# Altium schematic sheet [01] VS1053.SchDoc
size A4
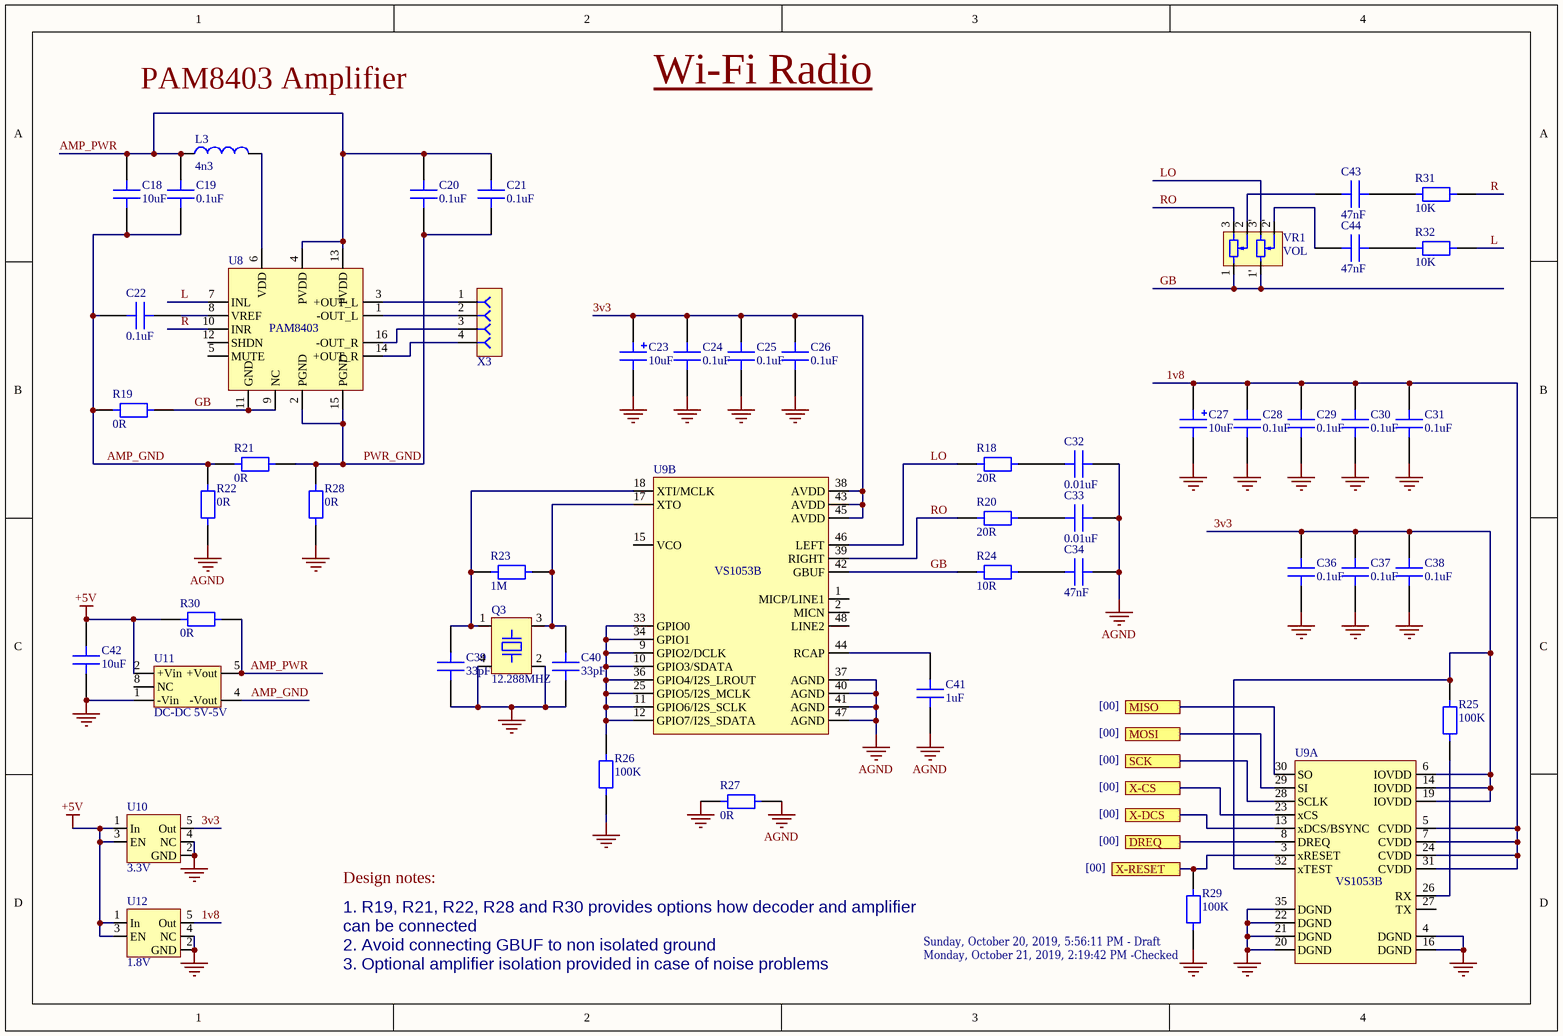
[diagram p0: [01] VS1053.SchDoc]

## Parts
C18  10uF  [CAP 0603]
C19  0.1uF  [CAP 0603]
C20  0.1uF  [CAP 0603]
C21  0.1uF  [CAP 0603]
C22  0.1uF  [CAP 0603]
C23  10uF  [CAP 1206]
C24  0.1uF  [CAP 0603]
C25  0.1uF  [CAP 0603]
C26  0.1uF  [CAP 0603]
C27  10uF  [CAP 1206]
C28  0.1uF  [CAP 0603]
C29  0.1uF  [CAP 0603]
C30  0.1uF  [CAP 0603]
C31  0.1uF  [CAP 0603]
C32  0.01uF  [CAP 0603]
C33  0.01uF  [CAP 0603]
C34  47nF  [CAP 0603]
C36  0.1uF  [CAP 0603]
C37  0.1uF  [CAP 0603]
C38  0.1uF  [CAP 0603]
C39  33pF  [CAP 0603]
C40  33pF  [CAP 0603]
C41  1uF  [CAP 0603]
C42  10uF  [CAP 0805]
C43  47nF  [CAP 0603]
C44  47nF  [CAP 0603]
L3  4n3  [IND 0603 LQW]
Q3  12.288MHZ  [ABM8W]
R18  20R  [RES 0603]
R19  0R  [RES 0805 - Jumper]
R20  20R  [RES 0603]
R21  0R  [RES 0805 - Jumper]
R22  0R  [RES 0805 - Jumper]
R23  1M  [RES 0603]
R24  10R  [RES 0603]
R25  100K  [RES 0603]
R26  100K  [RES 0603]
R27  0R  [RES 0603 - Jumper]
R28  0R  [RES 0805 - Jumper]
R29  100K  [RES 0603]
R30  0R  [RES 0805 - Jumper]
R31  10K  [RES 0603]
R32  10K  [RES 0603]
U8  PAM8403  [SOP-16]
U9  VS1053B  [LQFP-48]  (parts A,B of 2)
U10  3.3V  [SOT-23-5]
U11  DC-DC 5V-5V  [R1SE DC/DC]
U12  1.8V  [SOT-23-5]
VR1  VOL  [POT PTD902]
X3  0393570004  [TRMINAL 3.5MM]  (value not drawn)

## Ports
DREQ, MISO, MOSI, SCK, X-CS, X-DCS, X-RESET

## Nets
+5V: C42.2 R30.1 U10.1(In) U10.3(EN) U11.2(+Vin) U12.1(In) U12.3(EN)
AGND: C32.2 C33.2 C34.2 C41.1 R22.1 R27.2 U9.37(AGND) U9.40(AGND) U9.41(AGND) U9.47(AGND)
GND: C23.2 C24.1 C25.1 C26.1 C27.2 C28.1 C29.1 C30.1 C31.1 C36.1 C37.1 C38.1 C39.1 C40.1 C42.1 Q3.2(GND) Q3.4(GND) R26.1 R27.1 R28.1 R29.1 U9.4(DGND) U9.16(DGND) U9.20(DGND) U9.21(DGND) U9.22(DGND) U9.35(DGND) U10.2(GND) U10.4(NC) U11.1(-Vin) U12.2(GND) U12.4(NC)
1v8: C27.1 C28.2 C29.2 C30.2 C31.2 U9.5(CVDD) U9.7(CVDD) U9.24(CVDD) U9.31(CVDD) U12.5(Out)
3v3: C23.1 C24.2 C25.2 C26.2 C36.2 C37.2 C38.2 R25.1 U9.6(IOVDD) U9.14(IOVDD) U9.19(IOVDD) U9.32(xTEST) U9.38(AVDD) U9.43(AVDD) U9.45(AVDD) U10.5(Out)
AMP_GND: C18.1 C19.1 C22.2 R19.2 R21.1 R22.2 U11.4(-Vout)
AMP_PWR: C18.2 C19.2 C20.2 C21.2 L3.1 R30.2 U8.4(PVDD) U8.13(PVDD) U11.5(+Vout)
DREQ: U9.8(DREQ) ; port DREQ
GB: R19.1 R24.1 U8.9(NC) U8.11(GND) U9.42(GBUF) VR1.1 VR1.1'
L: R32.2 U8.7(INL)
LO: R18.1 U9.46(LEFT) VR1.3'
MISO: U9.30(SO) ; port MISO
MOSI: U9.29(SI) ; port MOSI
PWR_GND: C20.1 C21.1 R21.2 R28.2 U8.2(PGND) U8.15(PGND)
R: R31.2 U8.10(INR)
RO: R20.1 U9.39(RIGHT) VR1.3
SCK: U9.28(SCLK) ; port SCK
X-CS: U9.23(xCS) ; port X-CS
X-DCS: U9.13(xDCS/BSYNC) ; port X-DCS
X-RESET: R29.2 U9.3(xRESET) ; port X-RESET
NetC22_1: C22.1 U8.8(VREF)
NetC32_1: C32.1 R18.2
NetC33_1: C33.1 R20.2
NetC34_1: C34.1 R24.2
NetC39_2: C39.2 Q3.1 R23.1 U9.18(XTI/MCLK)
NetC40_2: C40.2 Q3.3 R23.2 U9.17(XTO)
NetC41_2: C41.2 U9.44(RCAP)
NetC43_1: C43.1 VR1.2
NetC43_2: C43.2 R31.1
NetC44_1: C44.1 VR1.2'
NetC44_2: C44.2 R32.1
NetL3_2: L3.2 U8.6(VDD)
NetR25_2: R25.2 U9.26(RX)
NetR26_2: R26.2 U9.9(GPIO2/DCLK) U9.10(GPIO3/SDATA) U9.11(GPIO6/I2S_SCLK) U9.12(GPIO7/I2S_SDATA) U9.25(GPIO5/I2S_MCLK) U9.33(GPIO0) U9.34(GPIO1) U9.36(GPIO4/I2S_LROUT)
NetU8_1: U8.1(-OUT_L) X3.2
NetU8_3: U8.3(+OUT_L) X3.1
NetU8_14: U8.14(+OUT_R) X3.4
NetU8_16: U8.16(-OUT_R) X3.3

Not connected (* = marked no-connect by the designer): U8 5(MUTE) 12(SHDN); U9 1(MICP/LINE1) 2(MICN) 15(VCO) 27(TX) 48(LINE2); U11 8(NC)

## Notes on the sheet
- PAM8403 Amplifier
- Wi-Fi Radio
- Volume Control
- VS1053B MP3 Decoder
- [00]
- Power
- Design notes:
- 1. R19, R21, R22, R28 and R30 provides options how decoder and amplifier can be connected
  2. Avoid connecting GBUF to non isolated ground
  3. Optional amplifier isolation provided in case of noise problems
- (near R29) Sunday, ‎October ‎20, ‎2019, ‏‎5:56:11 PM - Draft
- (near R29) ‎Monday, ‎October ‎21, ‎2019, ‏‎2:19:42 PM -Checked

## Library data of the parts
C18 = C0603C106M9PACTU: CAP CER 10UF 0603 6.3V; Manufacturer: KEMET; Dielectric Material: Ceramic; Tolerance: 20%; Dielectric: X5R; Supplier 1: Digi-Key; Supplier Part Number 1: 399-5504-1-ND; Manufacturer Part Number: C0603C106M9PACTU; Stock 1: 97190; Pricing 1: 1=0.49, 10=0.34, 100=0.2042, 500=0.1531, 1000=0.1293 (USD); Mount: Surface Mount; Case/Package: 0603; Min Operating Temperature: -55°C; Max Operating Temperature: 85°C; Capacitance: 10uF; Packaging: Tape and Reel; Voltage: 6.3V; Termination: SMD/SMT; Length: 1.6mm; Height: 0.8mm; Depth: 0.8mm; Radiation Hardening: No; ComponentLink1URL: http://www.farnell.com/datasheets/2739682.pdf?src-supplier=Farnell; ComponentLink1Description: http://www.farnell.com/datasheets/2739682.pdf?src-supplier=Farnell; ComponentLink2URL: http://uk.rs-online.com/webdocs/1515/0900766b8151511d.pdf?src-supplier=RSComponents; ComponentLink2Description: http://uk.rs-online.com/webdocs/1515/0900766b8151511d.pdf?src-supplier=RSComponents; ComponentLink3URL: http://www.farnell.com/datasheets/1918694.pdf?src-supplier=Farnell; ComponentLink3Description: http://www.farnell.com/datasheets/1918694.pdf?src-supplier=Farnell; ComponentLink4URL: http://www.farnell.com/datasheets/2315129.pdf?src-supplier=RSComponents; ComponentLink4Description: http://www.farnell.com/datasheets/2315129.pdf?src-supplier=RSComponents; ComponentLink5URL: http://www.kemet.com/kemet/web/homepage/kechome.nsf/weben/ADB5E2666EC6BA90CA2570A50016092E/$file/KEM_C1005_Y5V_SMD.pdf?src-supplier=Avnet; ComponentLink5Description: http://www.kemet.com/kemet/web/homepage/kechome.nsf/weben/ADB5E2666EC6BA90CA2570A50016092E/$file/KEM_C1005_Y5V_SMD.pdf?src-supplier=Avnet; ComponentLink6URL: http://www.farnell.com/datasheets/2315129.pdf?src-supplier=Verical; ComponentLink6Description: http://www.farnell.com/datasheets/2315129.pdf?src-supplier=Verical; ComponentLink7URL: http://www.farnell.com/datasheets/2739682.pdf?src-supplier=Newark; ComponentLink7Description: http://www.farnell.com/datasheets/2739682.pdf?src-supplier=Newark; ComponentLink8URL: https://api.kemet.com/component-edge/download/datasheet/C0603C106M9PACTU.pdf?src-supplier=Digi-Key; ComponentLink8Description: https://api.kemet.com/component-edge/download/datasheet/C0603C106M9PACTU.pdf?src-supplier=Digi-Key; ComponentLink9URL: http://www.farnell.com/datasheets/2123796.pdf?src-supplier=Element14; ComponentLink9Description: http://www.farnell.com/datasheets/2123796.pdf?src-supplier=Element14; ComponentLink10URL: http://www.farnell.com/datasheets/2315129.pdf?src-supplier=Avnet+Asia; ComponentLink10Description: http://www.farnell.com/datasheets/2315129.pdf?src-supplier=Avnet+Asia; ComponentLink11URL: http://www.farnell.com/datasheets/2315129.pdf?src-supplier=Allied+Electronics; ComponentLink11Description: http://www.farnell.com/datasheets/2315129.pdf?src-supplier=Allied+Electronics; ComponentLink12URL: http://components.arrow.com/part/dataview/0323_00011321?src-supplier=Arrow+Europe; ComponentLink12Description: http://components.arrow.com/part/dataview/0323_00011321?src-supplier=Arrow+Europe; ComponentLink13URL: http://components.arrow.com/part/dataview/42932973S8313645N7429?src-supplier=Arrow; ComponentLink13Description: http://components.arrow.com/part/dataview/42932973S8313645N7429?src-supplier=Arrow; ComponentLink14URL: http://www.farnell.com/datasheets/2315129.pdf?src-supplier=Mouser; ComponentLink14Description: http://www.farnell.com/datasheets/2315129.pdf?src-supplier=Mouser; ComponentLink15URL: https://www.verical.com/server-webapp/html/getDatasheet?partID=353664&src-supplier=Verical; ComponentLink15Description: https://www.verical.com/server-webapp/html/getDatasheet?partID=353664&src-supplier=Verical; ComponentLink16URL: http://capacitoredge.kemet.com/capedge2/DataSheet?pn=C0603C106M9PAC7867&src-supplier=Avnet; ComponentLink16Description: http://capacitoredge.kemet.com/capedge2/DataSheet?pn=C0603C106M9PAC7867&src-supplier=Avnet; ComponentLink17URL: http://www.farnell.com/datasheets/2315129.pdf?src-supplier=Distrelec; ComponentLink17Description: http://www.farnell.com/datasheets/2315129.pdf?src-supplier=Distrelec; ComponentLink18URL: http://www.kemet.com/kemet/web/homepage/kechome.nsf/file/Commercial%20Ceramic%20Chips%20X5R%20Dielectric/$file/KEM_C1006_X5R_SMD.pdf?src-supplier=Element14; ComponentLink18Description: http://www.kemet.com/kemet/web/homepage/kechome.nsf/file/Commercial%20Ceramic%20Chips%20X5R%20Dielectric/$file/KEM_C1006_X5R_SMD.pdf?src-supplier=Element14; ComponentLink19URL: http://www.farnell.com/datasheets/2315129.pdf?src-supplier=TME; ComponentLink19Description: http://www.farnell.com/datasheets/2315129.pdf?src-supplier=TME; ComponentLink20URL: http://www.farnell.com/datasheets/2315129.pdf?src-supplier=TTI; ComponentLink20Description: http://www.farnell.com/datasheets/2315129.pdf?src-supplier=TTI; ComponentLink21URL: http://www.farnell.com/datasheets/2315129.pdf?src-supplier=Quest; ComponentLink21Description: http://www.farnell.com/datasheets/2315129.pdf?src-supplier=Quest
C19-C22 C24-C26 C28-C31 C36-C38 = VJ0603Y104JXXAC: CAP CER 0.1uF 0603- SMD/SMT .1UF 25V 5% 0603; Manufacturer: Vishay Vitramon; Capacitance: 100nF; Dielectric: X7R; Supplier 1: Digi-Key; Supplier Part Number 1: 720-1545-1-ND; Manufacturer Part Number: VJ0603Y104JXXAC; Stock 1: 126786; Pricing 1: 1=0.34, 10=0.233, 100=0.1397, 500=0.1048, 1000=0.0885 (USD); Mount: Surface Mount; Case/Package: 0603; Case Code (Metric): 1608; Case Code (Imperial): 0603; Min Operating Temperature: -55°C; Max Operating Temperature: 125°C; Package Quantity: 4000; Voltage Rating: 25V; Tolerance: 5%; Packaging: Tape and Reel; Voltage Rating (DC): 25V; Termination: SMD/SMT; Length: 1.6mm; Width: 0.031inch; Thickness: 0.036inch; Depth: 0.8mm; Radiation Hardening: No; ComponentLink1URL: http://www.vishay.com/docs/45199/vjcommercialseries.pdf?src-supplier=Digi-Key; ComponentLink1Description: http://www.vishay.com/docs/45199/vjcommercialseries.pdf?src-supplier=Digi-Key
C23 C27 = 293D106X96R3A2TE3: CAP TANT 10UF 1206 6.3V 10%; Manufacturer: Vishay Sprague; Dielectric Material: Tantalum; ESR (Equivalent Series Resistance): 3.4R; Ripple Current: 150mA; Leakage Current: 600nA; Polarity: Polar; Dissipation Factor: 6%; Q Factor: 6; Supplier 1: Digi-Key; Supplier Part Number 1: 718-1126-1-ND; Manufacturer Part Number: 293D106X96R3A2TE3; Stock 1: 57716; Pricing 1: 1=0.3, 10=0.212, 100=0.127, 500=0.0952, 1000=0.0804 (USD); Mount: Surface Mount,PCB; Case/Package: 1206; Case Code (Metric): 3216; Case Code (Imperial): 1206; Min Operating Temperature: -55°C; Max Operating Temperature: 125°C; Capacitance: 10uF; Tolerance: 10%; Voltage Rating: 6.3V; Packaging: Tape and Reel; Voltage Rating (DC): 6.3V; Package Quantity: 1; Termination: SMD/SMT; Voltage: 6.3V; Features: General Purpose; Length: 3.2mm; Height: 1.6mm; Width: 1.6mm; Height - Seated (Max): 0.071inch; Depth: 1.6mm; Radiation Hardening: No; REACH SVHC: Unknown; Lead Free: Lead Free; ComponentLink1URL: http://www.vishay.com/docs/40002/293d.pdf?src-supplier=Avnet; ComponentLink1Description: http://www.vishay.com/docs/40002/293d.pdf?src-supplier=Avnet; ComponentLink2URL: http://www.farnell.com/datasheets/2045658.pdf?src-supplier=Element14; ComponentLink2Description: http://www.farnell.com/datasheets/2045658.pdf?src-supplier=Element14; ComponentLink3URL: http://documents.rs-components.com/techlib://itc_doclist_GB.htm?stockno=6843913&src-supplier=RSComponents; ComponentLink3Description: http://documents.rs-components.com/techlib://itc_doclist_GB.htm?stockno=6843913&src-supplier=RSComponents; ComponentLink4URL: https://www.alliedelec.com/m/d/7dc9f301682605e5c5665c787edb7bb9.pdf?src-supplier=Allied+Electronics; ComponentLink4Description: https://www.alliedelec.com/m/d/7dc9f301682605e5c5665c787edb7bb9.pdf?src-supplier=Allied+Electronics; ComponentLink5URL: http://www.vishay.com/docs/40002/293d.pdf?src-supplier=Digi-Key; ComponentLink5Description: http://www.vishay.com/docs/40002/293d.pdf?src-supplier=Digi-Key; ComponentLink6URL: http://www.mouser.com/ds/2/427/293d-239871.pdf?src-supplier=Mouser; ComponentLink6Description: http://www.mouser.com/ds/2/427/293d-239871.pdf?src-supplier=Mouser; ComponentLink7URL: http://www.vishay.com/docs/40002/293d.pdf?src-supplier=Avnet+Europe; ComponentLink7Description: http://www.vishay.com/docs/40002/293d.pdf?src-supplier=Avnet+Europe; ComponentLink8URL: http://www.farnell.com/datasheets/438417.pdf?src-supplier=Element14; ComponentLink8Description: http://www.farnell.com/datasheets/438417.pdf?src-supplier=Element14; Category: Capacitors
C32 C33 = VJ0603Y103KXAAC: CAP CER 0.01uF 0603 10 nF 50 V ±10 % Tolerance X7R SMT Multilayer Ceramic Chip Capacitor; Manufacturer: Vishay Vitramon; Tolerance: 10%; Capacitance: 10nF; Voltage Rating: 50V; Supplier 1: Digi-Key; Supplier Part Number 1: 720-1376-1-ND; Manufacturer Part Number: VJ0603Y103KXAAC; Stock 1: 728512; Pricing 1: 1=0.26, 10=0.179, 100=0.1013, 500=0.0715, 1000=0.0625 (USD); Mount: Surface Mount; Case/Package: 0603; Number of Pins: 2; Weight: 7.1E-05oz; Case Code (Metric): 1608; Case Code (Imperial): 0603; Contact Plating: Tin,Matte; Min Operating Temperature: -55°C; Max Operating Temperature: 125°C; Packaging: Tape and Reel; Package Quantity: 4000; Voltage Rating (DC): 50V; Dielectric: X7R; Termination: SMD/SMT; Voltage: 50V; Length: 1.6mm; Height: 0.92mm; Width: 0.031inch; Thickness: 0.036inch; Depth: 0.8mm; Radiation Hardening: No; REACH SVHC: Unknown; Lead Free: Lead Free; ComponentLink1URL: http://www.farnell.com/datasheets/1805045.pdf?src-supplier=Element14; ComponentLink1Description: http://www.farnell.com/datasheets/1805045.pdf?src-supplier=Element14; ComponentLink2URL: http://www.farnell.com/datasheets/2049137.pdf?src-supplier=Element14; ComponentLink2Description: http://www.farnell.com/datasheets/2049137.pdf?src-supplier=Element14; ComponentLink3URL: http://www.farnell.com/datasheets/50102.pdf?src-supplier=Element14; ComponentLink3Description: http://www.farnell.com/datasheets/50102.pdf?src-supplier=Element14; ComponentLink4URL: http://www.vishay.com/docs/45051/vjvitramonpackaging.pdf?src-supplier=Digi-Key; ComponentLink4Description: http://www.vishay.com/docs/45051/vjvitramonpackaging.pdf?src-supplier=Digi-Key
C34 C43 C44 = VJ0603Y473JXXCW1BC: CAP CER 47nF 0603 25 V ±5 % Tolerance X7R SMT Multilayer Ceramic Chip Capacitor; Manufacturer: Vishay Vitramon; Dielectric Material: Tantalum; Tolerance: 5%; Voltage Rating: 25V; Supplier 1: Digi-Key; Supplier Part Number 1: 720-1696-1-ND; Manufacturer Part Number: VJ0603Y473JXXCW1BC; Stock 1: 4000; Pricing 1: 1=0.19, 10=0.137, 100=0.0643, 500=0.0451, 1000=0.0373 (USD); Mount: Surface Mount; Case/Package: 0603; Case Code (Imperial): 0603; Case Code (Metric): 1608; Min Operating Temperature: -55°C; Max Operating Temperature: 125°C; Capacitance: 47nF; Packaging: Tape and Reel; Voltage Rating (DC): 25V; Package Quantity: 4000; Dielectric: X7R; Termination: SMD/SMT; Length: 1.6mm; Height: 0.95mm; Width: 0.8mm; Depth: 0.8mm; Radiation Hardening: No; Lead Free: Lead Free; ComponentLink1URL: http://www.vishay.com/docs/28548/vjw1bcbascomseries.pdf?src-supplier=Future+Electronics; ComponentLink1Description: http://www.vishay.com/docs/28548/vjw1bcbascomseries.pdf?src-supplier=Future+Electronics
C39 C40 = 251R14S330GV4T: CAP CER 33PF 0603 250V C0G/NP0; Manufacturer: Johanson; Dielectric Material: Ceramic; Tolerance: 2%; Dielectric: C0G; Temperature Coefficient: 30ppm/°C; Supplier 1: Digi-Key; Supplier Part Number 1: 712-1341-1-ND; Manufacturer Part Number: 251R14S330GV4T; Stock 1: 29771; Pricing 1: 1=0.56, 10=0.394, 100=0.2596, 500=0.1923, 1000=0.1634 (USD); Mount: Surface Mount; Case/Package: 0603; Number of Pins: 2; Case Code (Metric): 1608; Case Code (Imperial): 0603; Min Operating Temperature: -55°C; Max Operating Temperature: 125°C; Package Quantity: 4000; Capacitance: 33pF; Voltage Rating: 250V; Packaging: Tape and Reel; Voltage Rating (DC): 250V; Termination: SMD/SMT; Length: 0.062inch; Height: 0.89mm; Width: 0.032inch; Thickness: 0.035inch; Depth: 0.81mm; REACH SVHC: Unknown; ComponentLink1URL: http://www.farnell.com/datasheets/1731432.pdf?src-supplier=Element14; ComponentLink1Description: http://www.farnell.com/datasheets/1731432.pdf?src-supplier=Element14; ComponentLink2URL: http://www.farnell.com/datasheets/1318610.pdf?src-supplier=Element14; ComponentLink2Description: http://www.farnell.com/datasheets/1318610.pdf?src-supplier=Element14; ComponentLink3URL: http://www.farnell.com/datasheets/321205.pdf?src-supplier=Farnell; ComponentLink3Description: http://www.farnell.com/datasheets/321205.pdf?src-supplier=Farnell; ComponentLink4URL: http://www.mouser.com/ds/2/611/JTI-CAT-MLCC-HighQ-516212.pdf?src-supplier=Mouser; ComponentLink4Description: http://www.mouser.com/ds/2/611/JTI-CAT-MLCC-HighQ-516212.pdf?src-supplier=Mouser
C41 = VJ0603Y105KXJCW1BC: CAP CER 1uF 0603 16V X7R 10% SMD 125C Paper T/R; Manufacturer: Vishay Semiconductors; Dielectric Material: Tantalum; Supplier 1: Digi-Key; Supplier Part Number 1: 720-1852-1-ND; Manufacturer Part Number: VJ0603Y105KXJCW1BC; Stock 1: 970843; Pricing 1: 1=0.29, 10=0.196, 100=0.0991, 500=0.0678, 1000=0.06 (USD); Mount: Surface Mount; Case/Package: 0603; Min Operating Temperature: -55°C; Max Operating Temperature: 125°C; Capacitance: 1uF; Tolerance: 10%; Packaging: Tape and Reel; Dielectric: X7R; Voltage Rating (DC): 16V; Length: 1.6mm; Depth: 0.8mm; Radiation Hardening: No; Lead Free: Lead Free; ComponentLink1URL: http://www.vishay.com/docs/28548/vjw1bcbascomseries.pdf?src-supplier=Avnet; ComponentLink1Description: http://www.vishay.com/docs/28548/vjw1bcbascomseries.pdf?src-supplier=Avnet; ComponentLink2URL: http://www.vishay.com/docs/28548/vjw1bcbascomseries.pdf?src-supplier=Avnet+Europe; ComponentLink2Description: http://www.vishay.com/docs/28548/vjw1bcbascomseries.pdf?src-supplier=Avnet+Europe
C42 = C0805C106K8PACTU: CAP CER 10UF 0805 10V X5R; Manufacturer: KEMET; Dielectric Material: Ceramic; Tolerance: 10%; Supplier 1: Digi-Key; Supplier Part Number 1: 399-4925-1-ND; Manufacturer Part Number: C0805C106K8PACTU; Stock 1: 697432; Mount: Surface Mount; Case/Package: 0805; Number of Pins: 2; Contact Plating: Tin,Matte; Case Code (Imperial): 0805; Case Code (Metric): 2012; Min Operating Temperature: -55°C; Max Operating Temperature: 85°C; Capacitance: 10uF; Packaging: Tape and Reel; Dielectric: X5R; Voltage Rating (DC): 10V; Termination: SMD/SMT; Package Quantity: 1; Voltage Rating: 10V; Voltage: 10V; Dissipation Factor: 10%; Length: 2mm; Height: 1.25mm; Depth: 1.25mm; Width: 1.2mm; Thickness: 0.055inch; Radiation Hardening: No; REACH SVHC: No SVHC; ComponentLink1URL: http://www.farnell.com/datasheets/2739827.pdf?src-supplier=Element14; ComponentLink1Description: http://www.farnell.com/datasheets/2739827.pdf?src-supplier=Element14; ComponentLink2URL: http://www.farnell.com/datasheets/40889.pdf?src-supplier=Element14; ComponentLink2Description: http://www.farnell.com/datasheets/40889.pdf?src-supplier=Element14
L3 = LQW18AN4N3D00D: IND SMD 4.3nH 0603 850mA FIXED 59 MOHM; Manufacturer: Murata; Core Material: Non-Magnetic,Ferrite; Q Factor: 35; Self Resonant Frequency: 6GHz; Shielding: Unshielded; DC Resistance (DCR): 59mR; Test Frequency: 100MHz; Supplier 1: Digi-Key; Supplier Part Number 1: 490-1161-1-ND; Manufacturer Part Number: LQW18AN4N3D00D; Stock 1: 13187; Pricing 1: 1=0.17, 10=0.155, 100=0.1035, 500=0.0863, 1000=0.0725 (USD); Mount: Surface Mount; Case/Package: 0603; Weight: 0.000106oz; Case Code (Metric): 1608; Case Code (Imperial): 0603; Min Operating Temperature: -55°C; Max Operating Temperature: 125°C; Packaging: Tape and Reel; Inductance: 4.3nH; Package Quantity: 4000; Current Rating: 850mA; Max DC Current: 850mA; Termination: SMD/SMT; Composition: Wirewound; DC Current: 850mA; Military Standard: Not; Length: 1.6mm; Height: 0.8mm; Width: 0.8mm; Height - Seated (Max): 0.039inch; Depth: 1mm; Radiation Hardening: No; Lead Free: Lead Free; ComponentLink1URL: http://uk.rs-online.com/webdocs/1256/0900766b81256268.pdf?src-supplier=RSComponents; ComponentLink1Description: http://uk.rs-online.com/webdocs/1256/0900766b81256268.pdf?src-supplier=RSComponents; ComponentLink2URL: http://www.murata.com/~/media/webrenewal/support/library/catalog/products/inductor/chip/o05e.ashx?src-supplier=Digi-Key; ComponentLink2Description: http://www.murata.com/~/media/webrenewal/support/library/catalog/products/inductor/chip/o05e.ashx?src-supplier=Digi-Key; ComponentLink3URL: https://search.murata.co.jp/Ceramy/image/img/P02/JELF243A-0024.pdf?src-supplier=Digi-Key; ComponentLink3Description: https://search.murata.co.jp/Ceramy/image/img/P02/JELF243A-0024.pdf?src-supplier=Digi-Key
Q3 = ABM8W-12.2880MHZ-8-B1U-T3: CRYSTAL SMD 12.288MHZ Iot Optimized 12.29MHZ 8PF Crystal; Manufacturer: Abracon; Supplier 1: Digi-Key; Supplier Part Number 1: ABM8W-12.2880MHZ-8-B1U-T3-ND; Manufacturer Part Number: ABM8W-12.2880MHZ-8-B1U-T3; Stock 1: 0; Pricing 1: 3000=0.36 (USD); ComponentLink1URL: http://datasheet.octopart.com/ABM8W-12.2880MHZ-8-B1U-T3-Abracon-datasheet-101745424.pdf?src-supplier=Sager+Electronics; ComponentLink1Description: http://datasheet.octopart.com/ABM8W-12.2880MHZ-8-B1U-T3-Abracon-datasheet-101745424.pdf?src-supplier=Sager+Electronics
R18 R20 = CRCW060320R0FKEAHP: RES SMD 20 0603 1% 1/4W; Manufacturer: Vishay Dale; Power Rating: 250mW; Temperature Coefficient: 100ppm/°C; Voltage Rating: 75V; Supplier 1: Digi-Key; Supplier Part Number 1: 541-20.0SCT-ND; Manufacturer Part Number: CRCW060320R0FKEAHP; Stock 1: 2361; Pricing 1: 1=0.18, 10=0.149, 100=0.0581, 1000=0.0243, 2500=0.0223 (USD); Mount: Surface Mount; Case/Package: 0603; Weight: 7.1E-05oz; Case Code (Metric): 1608; Case Code (Imperial): 0603; Contact Plating: Tin; Min Operating Temperature: -55°C; Max Operating Temperature: 155°C; Resistance: 20R; Tolerance: 1%; Packaging: Tape and Reel; Package Quantity: 10; Composition: Thick Film; Number of Terminations: 2; Max Power Dissipation: 250mW; Features: Automotive AEC-Q200; Termination: Wraparound; Length: 1.6mm; Height: 0.45mm; Width: 0.033inch; Depth: 0.85mm; Radiation Hardening: No; Lead Free: Lead Free; ComponentLink1URL: http://www.vishay.com/docs/20043/crcwhpe3.pdf?src-supplier=Avnet; ComponentLink1Description: http://www.vishay.com/docs/20043/crcwhpe3.pdf?src-supplier=Avnet; ComponentLink2URL: http://www.vishay.com/docs/20043/crcwhpe3.pdf?src-supplier=Digi-Key; ComponentLink2Description: http://www.vishay.com/docs/20043/crcwhpe3.pdf?src-supplier=Digi-Key; ComponentLink3URL: http://www.vishay.com/doc?20043?src-supplier=Mouser; ComponentLink3Description: http://www.vishay.com/doc?20043?src-supplier=Mouser
R19 R21 R22 R28 R30 = CRCW08050000Z0EAHP: RES SMD 0R 0805 JUMPER 1/2W; Manufacturer: Vishay Dale; Resistance: 0mR; Tolerance: 5%; Power Rating: 330mW; Voltage Rating: 150V; Max Power Dissipation: 500mW; Temperature Coefficient: 0ppm/°C; Supplier 1: Digi-Key; Supplier Part Number 1: 541-0.0TBCT-ND; Manufacturer Part Number: CRCW08050000Z0EAHP; Stock 1: 330626; Pricing 1: 1=0.25, 10=0.213, 25=0.1548, 50=0.1122, 100=0.0832, 250=0.0639, 500=0.0503, 1000=0.0349 (USD); Mount: Surface Mount; Case/Package: 0805; Number of Pins: 2; Weight: 0.000194oz; Case Code (Metric): 2012; Case Code (Imperial): 0805; Contact Plating: Tin; Min Operating Temperature: -55°C; Max Operating Temperature: 155°C; Packaging: Tape and Reel; Package Quantity: 5000; Composition: Thick Film; Number of Terminations: 2; Military Standard: Not; Termination: Solder; Voltage Rating (DC): 150V; Features: Automotive AEC-Q200; Length: 2mm; Height: 0.024inch; Width: 0.049inch; Depth: 1.25mm; Radiation Hardening: No; REACH SVHC: No SVHC; Lead Free: Lead Free; ComponentLink1URL: http://www.vishay.com/docs/20043/crcwhpe3.pdf?src-supplier=Future+Electronics; ComponentLink1Description: http://www.vishay.com/docs/20043/crcwhpe3.pdf?src-supplier=Future+Electronics; ComponentLink2URL: http://www.vishay.com/docs/20043/crcwhpe3.pdf?src-supplier=Digi-Key; ComponentLink2Description: http://www.vishay.com/docs/20043/crcwhpe3.pdf?src-supplier=Digi-Key; ComponentLink3URL: http://www.mouser.com/ds/2/427/crcwhpe3-46056.pdf?src-supplier=Mouser; ComponentLink3Description: http://www.mouser.com/ds/2/427/crcwhpe3-46056.pdf?src-supplier=Mouser; ComponentLink4URL: http://www.vishay.com/docs/20043/crcwhpe3.pdf?src-supplier=Avnet+Europe; ComponentLink4Description: http://www.vishay.com/docs/20043/crcwhpe3.pdf?src-supplier=Avnet+Europe; ComponentLink5URL: http://www.vishay.com/docs/20043/crcwhpe3.pdf?src-supplier=Avnet; ComponentLink5Description: http://www.vishay.com/docs/20043/crcwhpe3.pdf?src-supplier=Avnet; ComponentLink6URL: http://www.farnell.com/datasheets/2046716.pdf?src-supplier=Element14; ComponentLink6Description: http://www.farnell.com/datasheets/2046716.pdf?src-supplier=Element14
R23 = CRCW06031M00FKEA: RES SMD 1M 0603 1% 1/10W; Manufacturer: Vishay; Power Rating: 100mW; Resistance: 1MR; Voltage Rating: 75V; Temperature Coefficient: 100ppm/°C; Supplier 1: Digi-Key; Supplier Part Number 1: 541-1.00MHCT-ND; Manufacturer Part Number: CRCW06031M00FKEA; Stock 1: 466723; Pricing 1: 1=0.1, 10=0.036, 100=0.0146, 1000=0.0065, 2500=0.0057 (USD); Mount: Surface Mount; Case/Package: 0603; Number of Pins: 2; Weight: 7.1E-05oz; Case Code (Imperial): 0603; Case Code (Metric): 1608; Contact Plating: Tin; Min Operating Temperature: -55°C; Max Operating Temperature: 155°C; Tolerance: 1%; Packaging: Tape and Reel; Composition: Thick Film; Package Quantity: 10; Number of Terminations: 2; Termination: SMD/SMT; Military Standard: Not; Voltage Rating (DC): 75V; Max Power Dissipation: 100mW; Features: Automotive AEC-Q200; Length: 1.55mm; Height: 0.45mm; Width: 0.85mm; Depth: 0.85mm; Radiation Hardening: No; REACH SVHC: Unknown; Lead Free: Lead Free; ComponentLink1URL: http://uk.rs-online.com/webdocs/0d98/0900766b80d98afc.pdf?src-supplier=RSComponents; ComponentLink1Description: http://uk.rs-online.com/webdocs/0d98/0900766b80d98afc.pdf?src-supplier=RSComponents; ComponentLink2URL: https://www.distrelec.biz/Web/Downloads/a_/en/flD-CRCW-e3_data_en.pdf?mime=application%2Fpdf&src-supplier=Distrelec; ComponentLink2Description: https://www.distrelec.biz/Web/Downloads/a_/en/flD-CRCW-e3_data_en.pdf?mime=application%2Fpdf&src-supplier=Distrelec; ComponentLink3URL: http://www.vishay.com/docs/20035/dcrcwe3.pdf?src-supplier=Digi-Key; ComponentLink3Description: http://www.vishay.com/docs/20035/dcrcwe3.pdf?src-supplier=Digi-Key; ComponentLink4URL: http://www.vishay.com/docs/20035/dcrcwe3.pdf?src-supplier=Future+Electronics; ComponentLink4Description: http://www.vishay.com/docs/20035/dcrcwe3.pdf?src-supplier=Future+Electronics; ComponentLink5URL: http://www.farnell.com/datasheets/2310790.pdf?src-supplier=Element14; ComponentLink5Description: http://www.farnell.com/datasheets/2310790.pdf?src-supplier=Element14; ComponentLink6URL: http://www.farnell.com/datasheets/125364.pdf?src-supplier=Element14; ComponentLink6Description: http://www.farnell.com/datasheets/125364.pdf?src-supplier=Element14
R24 = RCA060310R0FKEAHP: RES SMD 10 0603 1% 1/4W; Manufacturer: Vishay Dale; Core Material: Non-Magnetic; Tolerance: 2%; Max Power Dissipation: 250mW; Temperature Coefficient: 100ppm/°C; Inductance: 15nH; Current Rating: 700mA; Shielding: Unshielded; DC Resistance (DCR): 170mR; Self Resonant Frequency: 4GHz; Test Frequency: 250MHz; Supplier 1: Digi-Key; Supplier Part Number 1: 541-3243-1-ND; Manufacturer Part Number: RCA060310R0FKEAHP; Stock 1: 23109; Pricing 1: 1=0.18, 10=0.156, 100=0.0611, 1000=0.0256, 2500=0.0234 (USD); Mount: Surface Mount; Case/Package: 0603; Case Code (Imperial): 0603; Case Code (Metric): 1608; Min Operating Temperature: -55°C; Max Operating Temperature: 125°C; Composition: Thick Film,Wirewound; Features: Automotive AEC-Q200,Anti-Sulfur; Packaging: Cut Tape; Resistance: 10R; Number of Terminations: 2; Ratings: AEC-Q200; ComponentLink1URL: http://www.vishay.com/docs/20067/rcahp.pdf?src-supplier=Digi-Key; ComponentLink1Description: http://www.vishay.com/docs/20067/rcahp.pdf?src-supplier=Digi-Key
R25 R26 R29 = CRCW0603-100KFKEA: RES SMD 100K 0603 0.1W 1% SMT TCR 37 ppm/DegC; Manufacturer: Vishay; Power Rating: 100mW; Resistance: 100kR; Voltage Rating: 75V; Temperature Coefficient: 100ppm/°C; Supplier 1: Digi-Key; Supplier Part Number 1: 541-100KHDKR-ND; Manufacturer Part Number: CRCW0603-100KFKEA; Stock 1: 945194; Pricing 1: 1=0.1, 10=0.037, 100=0.0151, 1000=0.0068, 2500=0.0059 (USD); Case/Package: 0603; Number of Pins: 2; Weight: 7.1E-05oz; Case Code (Metric): 1608; Case Code (Imperial): 0603; Contact Plating: Tin,Lead; Min Operating Temperature: -55°C; Max Operating Temperature: 155°C; Packaging: Tape and Reel; Tolerance: 1%; Package Quantity: 10; Composition: Thick Film; Number of Terminations: 2; Termination: SMD/SMT; Military Standard: Not; Max Power Dissipation: 100mW; Voltage Rating (DC): 75V; Features: Automotive AEC-Q200; Length: 1.55mm; Height: 0.45mm; Width: 0.033inch; Depth: 0.85mm; Radiation Hardening: No; REACH SVHC: Unknown; Lead Free: Lead Free; ComponentLink1URL: http://www.vishay.com/docs/20035/dcrcwe3.pdf?src-supplier=Digi-Key; ComponentLink1Description: http://www.vishay.com/docs/20035/dcrcwe3.pdf?src-supplier=Digi-Key; ComponentLink2URL: http://www.farnell.com/datasheets/2310790.pdf?src-supplier=Element14; ComponentLink2Description: http://www.farnell.com/datasheets/2310790.pdf?src-supplier=Element14; ComponentLink3URL: https://www.verical.com/server-webapp/html/getDatasheet?partID=93113&src-supplier=Verical; ComponentLink3Description: https://www.verical.com/server-webapp/html/getDatasheet?partID=93113&src-supplier=Verical; ComponentLink4URL: http://www.farnell.com/datasheets/2045673.pdf?src-supplier=Element14; ComponentLink4Description: http://www.farnell.com/datasheets/2045673.pdf?src-supplier=Element14; ComponentLink5URL: http://www.farnell.com/datasheets/2310790.pdf?src-supplier=Avnet; ComponentLink5Description: http://www.farnell.com/datasheets/2310790.pdf?src-supplier=Avnet; ComponentLink6URL: http://www.farnell.com/datasheets/2310790.pdf?src-supplier=Allied+Electronics; ComponentLink6Description: http://www.farnell.com/datasheets/2310790.pdf?src-supplier=Allied+Electronics; ComponentLink7URL: http://www.vishay.com/docs/20035/dcrcwe3.pdf?src-supplier=Avnet; ComponentLink7Description: http://www.vishay.com/docs/20035/dcrcwe3.pdf?src-supplier=Avnet; ComponentLink8URL: http://www.farnell.com/datasheets/2310790.pdf?src-supplier=Mouser; ComponentLink8Description: http://www.farnell.com/datasheets/2310790.pdf?src-supplier=Mouser; ComponentLink9URL: http://uk.rs-online.com/webdocs/0d98/0900766b80d98afc.pdf?src-supplier=RSComponents; ComponentLink9Description: http://uk.rs-online.com/webdocs/0d98/0900766b80d98afc.pdf?src-supplier=RSComponents; ComponentLink10URL: http://www.farnell.com/datasheets/2310790.pdf?src-supplier=Distrelec; ComponentLink10Description: http://www.farnell.com/datasheets/2310790.pdf?src-supplier=Distrelec; ComponentLink11URL: http://www.vishay.com/docs/20008/dcrcw.pdf?src-supplier=Avnet+Europe; ComponentLink11Description: http://www.vishay.com/docs/20008/dcrcw.pdf?src-supplier=Avnet+Europe
R27 = CRCW0603-0000Z0EA: RES SMD 0R 0603 JUMPER PU=5000 ST, CRCW06030000Z0EA, Vishay; Resistance: 0mR; Power Rating: 100mW; Voltage Rating: 75V; Tolerance: 5%; Temperature Coefficient: 100ppm/°C; Current Rating: 2A; Supplier 1: Allied Electronics; Supplier Part Number 1: 70202889; Manufacturer: Vishay; Manufacturer Part Number: CRCW0603-0000Z0EA; Stock 1: 0; Mount: Surface Mount; Case/Package: 0603; Weight: 7.1E-05oz; Case Code (Metric): 1608; Case Code (Imperial): 0603; Contact Plating: Tin,Lead; Min Operating Temperature: -55°C; Max Operating Temperature: 155°C; Packaging: Tape and Reel; Package Quantity: 1; Composition: Thick Film; Number of Terminations: 2; Termination: SMD/SMT; Military Standard: Not; Max Power Dissipation: 100mW; Voltage Rating (DC): 75V; Working Voltage: 75V; Features: Automotive AEC-Q200; Length: 1.55mm; Height: 0.02inch; Width: 0.033inch; Depth: 0.85mm; Radiation Hardening: No; REACH SVHC: Unknown; Lead Free: Lead Free; ComponentLink1URL: http://www.vishay.com/docs/20035/dcrcwe3.pdf?src-supplier=Digi-Key; ComponentLink1Description: http://www.vishay.com/docs/20035/dcrcwe3.pdf?src-supplier=Digi-Key; ComponentLink2URL: http://www.farnell.com/datasheets/2310790.pdf?src-supplier=Avnet; ComponentLink2Description: http://www.farnell.com/datasheets/2310790.pdf?src-supplier=Avnet; ComponentLink3URL: http://www.vishay.com/docs/20008/dcrcw.pdf?src-supplier=Avnet+Europe; ComponentLink3Description: http://www.vishay.com/docs/20008/dcrcw.pdf?src-supplier=Avnet+Europe; ComponentLink4URL: http://www.vishay.com/docs/20035/dcrcwe3.pdf?src-supplier=Future+Electronics; ComponentLink4Description: http://www.vishay.com/docs/20035/dcrcwe3.pdf?src-supplier=Future+Electronics; ComponentLink5URL: http://www.alliedelec.com/m/d/0c934d6939ccefa68dbe0b96d821c8cf.pdf?src-supplier=Allied+Electronics; ComponentLink5Description: http://www.alliedelec.com/m/d/0c934d6939ccefa68dbe0b96d821c8cf.pdf?src-supplier=Allied+Electronics; ComponentLink6URL: https://www.distrelec.biz/Web/Downloads/a_/en/flD-CRCW-e3_data_en.pdf?mime=application%2Fpdf&src-supplier=Distrelec; ComponentLink6Description: https://www.distrelec.biz/Web/Downloads/a_/en/flD-CRCW-e3_data_en.pdf?mime=application%2Fpdf&src-supplier=Distrelec; ComponentLink7URL: http://www.farnell.com/datasheets/2310790.pdf?src-supplier=Mouser; ComponentLink7Description: http://www.farnell.com/datasheets/2310790.pdf?src-supplier=Mouser; ComponentLink8URL: http://www.farnell.com/datasheets/2310790.pdf?src-supplier=Element14; ComponentLink8Description: http://www.farnell.com/datasheets/2310790.pdf?src-supplier=Element14; ComponentLink9URL: http://www.farnell.com/datasheets/125364.pdf?src-supplier=Element14; ComponentLink9Description: http://www.farnell.com/datasheets/125364.pdf?src-supplier=Element14
R31 R32 = CRCW060310K0FKEA: RES SMD 10K 0603 1% 1/10W; Manufacturer: Vishay; Resistance: 10kR; Power Rating: 100mW; Voltage Rating: 75V; Temperature Coefficient: 100ppm/°C; Supplier 1: Digi-Key; Supplier Part Number 1: 541-10.0KHCT-ND; Manufacturer Part Number: CRCW060310K0FKEA; Stock 1: 2959816; Pricing 1: 1=0.1, 10=0.036, 100=0.0146, 1000=0.0065, 2500=0.0057 (USD); Case/Package: 0603; Number of Pins: 2; Weight: 7.1E-05oz; Case Code (Metric): 1608; Case Code (Imperial): 0603; Contact Plating: Tin,Lead; Min Operating Temperature: -55°C; Max Operating Temperature: 155°C; Tolerance: 1%; Packaging: Tape and Reel; Package Quantity: 10; Composition: Thick Film; Number of Terminations: 2; Military Standard: Not; Termination: SMD/SMT; Max Power Dissipation: 100mW; Voltage Rating (DC): 75V; Features: Automotive AEC-Q200; Length: 1.55mm; Height: 0.45mm; Width: 0.033inch; Depth: 0.85mm; Radiation Hardening: No; REACH SVHC: Unknown; Lead Free: Lead Free; ComponentLink1URL: http://www.vishay.com/docs/20008/dcrcw.pdf?src-supplier=Avnet+Europe; ComponentLink1Description: http://www.vishay.com/docs/20008/dcrcw.pdf?src-supplier=Avnet+Europe; ComponentLink2URL: https://www.verical.com/server-webapp/html/getDatasheet?partID=86831&src-supplier=Verical; ComponentLink2Description: https://www.verical.com/server-webapp/html/getDatasheet?partID=86831&src-supplier=Verical; ComponentLink3URL: http://www.farnell.com/datasheets/2310790.pdf?src-supplier=Allied+Electronics; ComponentLink3Description: http://www.farnell.com/datasheets/2310790.pdf?src-supplier=Allied+Electronics; ComponentLink4URL: http://www.vishay.com/docs/20035/dcrcwe3.pdf?src-supplier=Digi-Key; ComponentLink4Description: http://www.vishay.com/docs/20035/dcrcwe3.pdf?src-supplier=Digi-Key; ComponentLink5URL: http://www.farnell.com/datasheets/2310790.pdf?src-supplier=Mouser; ComponentLink5Description: http://www.farnell.com/datasheets/2310790.pdf?src-supplier=Mouser; ComponentLink6URL: http://www.farnell.com/datasheets/2310790.pdf?src-supplier=Element14; ComponentLink6Description: http://www.farnell.com/datasheets/2310790.pdf?src-supplier=Element14; ComponentLink7URL: http://www.farnell.com/datasheets/2310790.pdf?src-supplier=Avnet; ComponentLink7Description: http://www.farnell.com/datasheets/2310790.pdf?src-supplier=Avnet; ComponentLink8URL: http://www.vishay.com/docs/20035/dcrcwe3.pdf?src-supplier=Future+Electronics; ComponentLink8Description: http://www.vishay.com/docs/20035/dcrcwe3.pdf?src-supplier=Future+Electronics; ComponentLink9URL: http://uk.rs-online.com/webdocs/0d98/0900766b80d98afc.pdf?src-supplier=RSComponents; ComponentLink9Description: http://uk.rs-online.com/webdocs/0d98/0900766b80d98afc.pdf?src-supplier=RSComponents; ComponentLink10URL: http://www.farnell.com/datasheets/2310790.pdf?src-supplier=Distrelec; ComponentLink10Description: http://www.farnell.com/datasheets/2310790.pdf?src-supplier=Distrelec
U8 = PAM8403DR-H: IC AMP AUDIO 3W CLASS D 16SOIC; Manufacturer: Diodes; Voltage Gain: 24dB; Min Supply Voltage: 2.5V; Max Supply Voltage: 5.5V; Power Supply Rejection Ratio (PSRR): 59dB; Operating Supply Voltage: 5V; Supplier 1: Digi-Key; Supplier Part Number 1: PAM8403DR-HDICT-ND; Manufacturer Part Number: PAM8403DR-H; Stock 1: 8119; Pricing 1: 1=0.81, 10=0.714, 100=0.5472, 500=0.4326, 1000=0.3461 (USD); Mount: Surface Mount; Case/Package: SOP; Number of Pins: 16; Min Operating Temperature: -40°C; Max Operating Temperature: 85°C; Packaging: Tape and Reel; Package Quantity: 2500; Max Output Power: 3W; Radiation Hardening: No; ComponentLink1URL: http://www.diodes.com/datasheets/PAM8403H.pdf?src-supplier=Avnet; ComponentLink1Description: http://www.diodes.com/datasheets/PAM8403H.pdf?src-supplier=Avnet; ComponentLink2URL: https://www.diodes.com/assets/Datasheets/PAM8403H.pdf?src-supplier=Digi-Key; ComponentLink2Description: https://www.diodes.com/assets/Datasheets/PAM8403H.pdf?src-supplier=Digi-Key
U9 = 1681: IC VS1053B MP3/WAV/OGG/MIDI Player & Recorder (CODEC) Chip; Manufacturer: Adafruit Industries; Supplier 1: Digi-Key; Supplier Part Number 1: 1528-2645-ND; Manufacturer Part Number: 1681; Stock 1: 133; Pricing 1: 1=12.5 (USD)
U10 = TLV70233DBVR: IC REG LIN 3.3V 300mALow IQLDO Reg; Manufacturer: Texas Instruments; Output Current: 300mA; Number of Outputs: 1; Max Power Dissipation: 500mW; Dropout Voltage: 375mV; Max Input Voltage: 5.5V; Min Input Voltage: 2V; Min Current Limit: 320mA; Polarity: Positive; Output Voltage Accuracy: 0.5%; Accuracy: 2%; Quiescent Current: 30uA; Power Supply Rejection Ratio (PSRR): 68dB; Output Type: Fixed; Supplier 1: Digi-Key; Supplier Part Number 1: 296-32415-1-ND; Manufacturer Part Number: TLV70233DBVR; Stock 1: 29164; Pricing 1: 1=0.5, 10=0.428, 100=0.3192, 500=0.2508, 1000=0.1938 (USD); Case/Package: SOT-23-5; Number of Pins: 5; Min Operating Temperature: -40°C; Max Operating Temperature: 125°C; Output Voltage: 3.3V; Packaging: Tape and Reel; Package Quantity: 1; Nominal Output Voltage: 3.3V; Max Output Current: 300mA; Number of Regulators: 1; Power Dissipation: 500mW; Min Output Voltage: 3.3V; Max Output Voltage: 3.3V; Radiation Hardening: No; REACH SVHC: No SVHC; Lead Free: Lead Free; ComponentLink1URL: http://www.farnell.com/datasheets/1882072.pdf?src-supplier=Element14; ComponentLink1Description: http://www.farnell.com/datasheets/1882072.pdf?src-supplier=Element14; ComponentLink2URL: http://www.ti.com/lit/ds/symlink/tlv702.pdf?src-supplier=Digi-Key; ComponentLink2Description: http://www.ti.com/lit/ds/symlink/tlv702.pdf?src-supplier=Digi-Key
U11 = R1SE-0505-R: DC DC CONVERTER 5V 1W; Manufacturer: Recom; Number of Outputs: 1; Efficiency: 75%; Min Input Voltage: 4.5V; Max Input Voltage: 5.5V; Max Output Current: 200mA; Isolation Voltage: 1kV; Isolation: Isolated; Supplier 1: Digi-Key; Supplier Part Number 1: 945-1659-1-ND; Manufacturer Part Number: R1SE-0505-R; Stock 1: 12574; Pricing 1: 1=3.21, 5=3.162, 10=3.117, 25=3.0252, 50=2.9334, 100=2.8418, 250=2.7501 (USD); Mount: Surface Mount; Case/Package: SMD/SMT; Number of Pins: 5; Weight: 1g; Min Operating Temperature: -40°C; Max Operating Temperature: 85°C; Packaging: Tape and Reel; Package Quantity: 1; Output Voltage: 5V; Nominal Output Voltage: 5V; Nominal Input Voltage: 5V; Output Power: 1W; Output Current: 200mA; Min Input Voltage (DC): 4.5V; Voltage - Output 1: 5V; Current - Output 1: 200mA; Max Input Voltage (DC): 5.5V; Max Output Power: 1W; Max Power Dissipation: 1W; Max Output Voltage: 5V; Features: SCP; Length: 12.75mm; Height: 6.7mm; Width: 10.7mm; Depth: 12.75mm; REACH SVHC: No SVHC; Lead Free: Lead Free; ComponentLink1URL: http://www.rapidonline.com/pdf/676127_da_en_01.pdf?src-supplier=Rapid+Electronics; ComponentLink1Description: http://www.rapidonline.com/pdf/676127_da_en_01.pdf?src-supplier=Rapid+Electronics; ComponentLink2URL: https://www.recom-power.com/pdf/Econoline/R1SE.pdf?src-supplier=Digi-Key; ComponentLink2Description: https://www.recom-power.com/pdf/Econoline/R1SE.pdf?src-supplier=Digi-Key; ComponentLink3URL: http://www.farnell.com/datasheets/1662785.pdf?src-supplier=Element14; ComponentLink3Description: http://www.farnell.com/datasheets/1662785.pdf?src-supplier=Element14
U12 = TLV70218DBVT: IC REG LIN 1.8V 300MA SOT23-5; Manufacturer: Texas Instruments; Dropout Voltage: 220mV; Number of Outputs: 1; Max Power Dissipation: 500mW; Max Input Voltage: 5.5V; Min Input Voltage: 2V; Min Current Limit: 320mA; Polarity: Positive; Quiescent Current: 30uA; Accuracy: 2%; Output Voltage Accuracy: 0.5%; Output Type: Fixed; Supplier 1: Digi-Key; Supplier Part Number 1: 296-27889-1-ND; Manufacturer Part Number: TLV70218DBVT; Stock 1: 3659; Pricing 1: 1=0.58, 10=0.495, 100=0.3696 (USD); Case/Package: SOT-23; Number of Pins: 5; Contact Plating: Gold; Min Operating Temperature: -40°C; Max Operating Temperature: 125°C; Nominal Output Voltage: 1.8V; Output Current: 300mA; Output Voltage: 1.8V; Packaging: Tape and Reel; Package Quantity: 1; Max Output Current: 300mA; Number of Regulators: 1; Power Dissipation: 500mW; Min Output Voltage: 1.8V; Power Rating: 500mW; Max Output Voltage: 1.8V; Length: 3.05mm; Height: 1.3mm; Width: 1.75mm; REACH SVHC: No SVHC; Lead Free: Lead Free; ComponentLink1URL: http://www.ti.com/lit/ds/symlink/tlv702.pdf?src-supplier=Digi-Key; ComponentLink1Description: http://www.ti.com/lit/ds/symlink/tlv702.pdf?src-supplier=Digi-Key
VR1 = PTD902-1025K-B503: POT 50K LINEAR; Manufacturer: Bourns; Resistance: 50kR; Power Rating: 50mW; Tolerance: 10%; Number of Gangs: 2; Number of Turns: 1; Actuator Length: 0.984inch; Actuator Diameter: 0.236inch; Supplier 1: Digi-Key; Supplier Part Number 1: PTD902-1025K-B503-ND; Manufacturer Part Number: PTD902-1025K-B503; Stock 1: 183; Pricing 1: 1=2.01, 10=1.769, 25=1.586, 50=1.525, 108=1.464, 324=1.403, 540=1.159, 1080=1.098, 5076=0.915 (USD); Mount: Panel,Through Hole; Min Operating Temperature: -10°C; Max Operating Temperature: 50°C; Package Quantity: 108; Packaging: Bulk; Taper: Linear; Termination: Pin; Composition: Carbon; Military Standard: Not; Max Power Dissipation: 50mW; Type: Potentiometer; Length: 34.65mm; Depth: 9.5mm; Radiation Hardening: No; ComponentLink1URL: http://www.bourns.com/docs/Product-Datasheets/PTD90.pdf?src-supplier=Digi-Key; ComponentLink1Description: http://www.bourns.com/docs/Product-Datasheets/PTD90.pdf?src-supplier=Digi-Key; ComponentLink2URL: http://www.mouser.com/ds/2/54/TD90-777943.pdf?src-supplier=Mouser; ComponentLink2Description: http://www.mouser.com/ds/2/54/TD90-777943.pdf?src-supplier=Mouser
X3 = 0393570004: TERMINAL 4 POS 3.5mm Solder ST Thru-Hole 17.5A/Contact Eurostyle™; Manufacturer: Molex; Plating: Nickel; Max Voltage Rating (AC): 300V; Number of Contacts: 4; Number of Levels: 1; Current: 12A; Wire Gauge (Max): 28AWG; Wire Gauge (Min): 16AWG; Pitch: 0.138inch; Supplier 1: Digi-Key; Supplier Part Number 1: WM7860-ND; Manufacturer Part Number: 0393570004; Stock 1: 0; Mount: Through Hole; Color: Black; Contact Plating: Tin; Contact Material: Copper; Housing Color: Black; Housing Material: Polyamide; Min Operating Temperature: -40°C; Max Operating Temperature: 85°C; Packaging: Bulk; Number of Rows: 1; Termination: Solder; Orientation: Straight; Number of Positions Per Level: 4; Voltage: 300V; Max Supply Voltage (AC): 300V; Length: 14mm; Depth: 7.29mm; Radiation Hardening: No; ComponentLink1URL: https://www.verical.com/server-webapp/html/getDatasheet?partID=242364&src-supplier=Verical; ComponentLink1Description: https://www.verical.com/server-webapp/html/getDatasheet?partID=242364&src-supplier=Verical